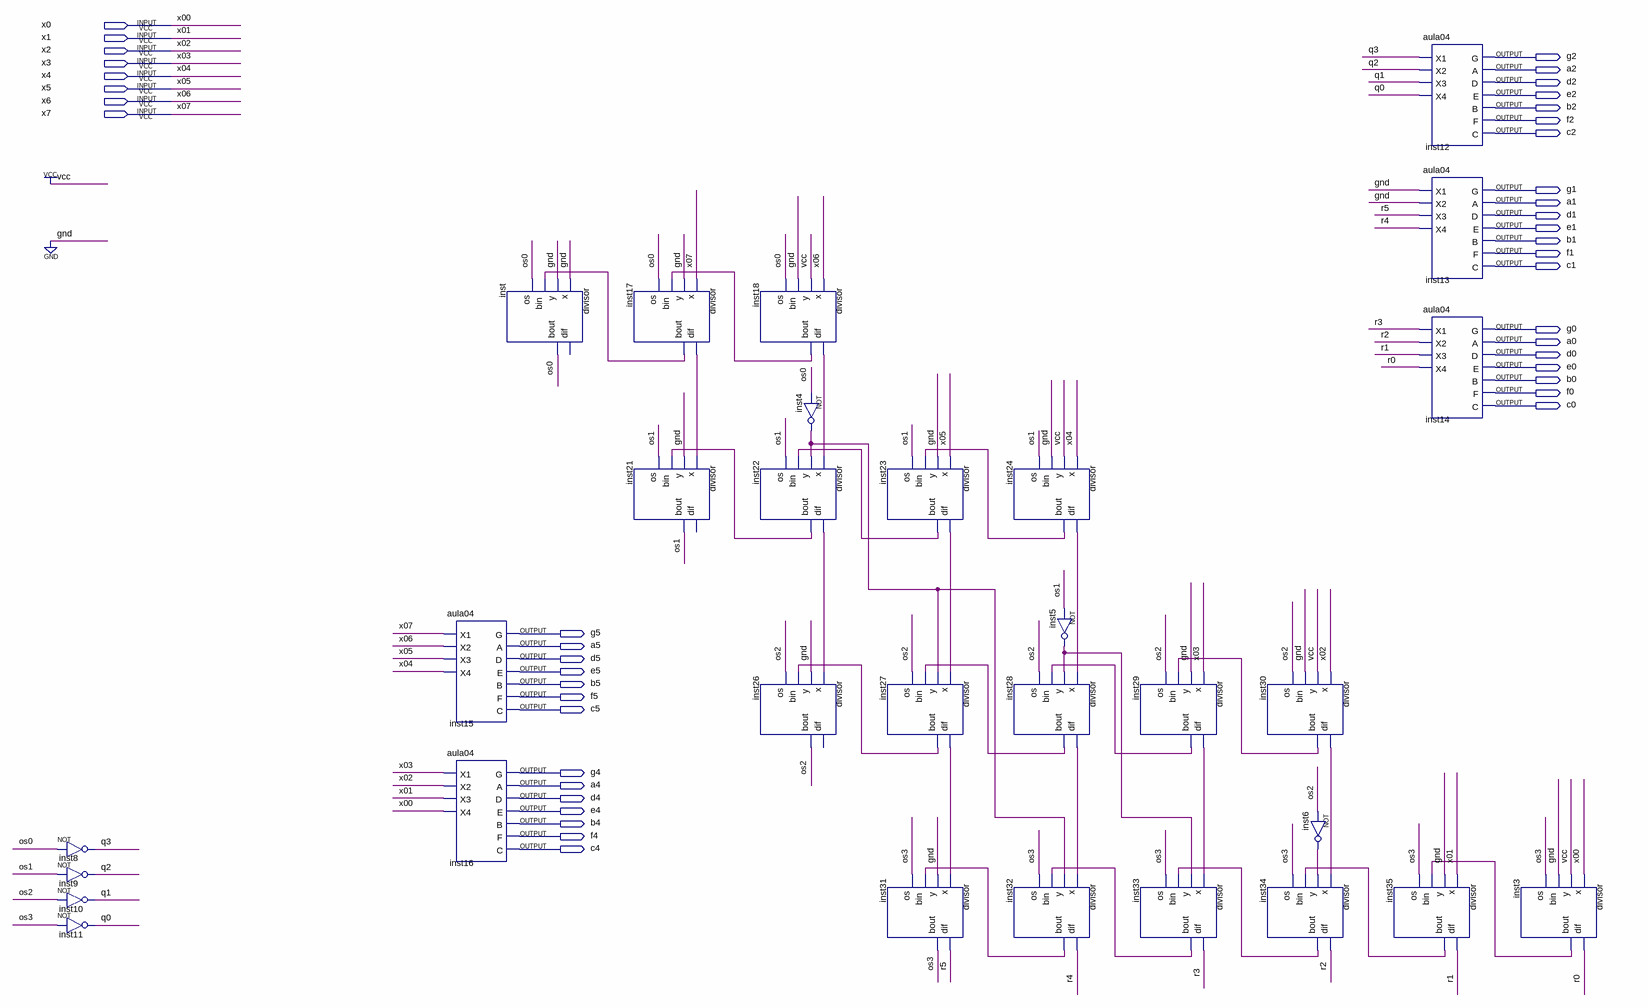
[diagram p0: schematic sheet]
// Quartus schematic aula12.bdf as structural Verilog: 30 symbols, 43 pins
module aula12 (
  input  x0,
  input  x1,
  input  x2,
  input  x3,
  input  x4,
  input  x5,
  input  x6,
  input  x7,
  output g2,
  output a2,
  output d2,
  output e2,
  output b2,
  output f2,
  output c2,
  output g1,
  output a1,
  output d1,
  output e1,
  output b1,
  output f1,
  output c1,
  output g0,
  output a0,
  output d0,
  output e0,
  output b0,
  output f0,
  output c0,
  output g5,
  output a5,
  output d5,
  output e5,
  output b5,
  output f5,
  output c5,
  output g4,
  output a4,
  output d4,
  output e4,
  output b4,
  output f4,
  output c4
);

  wire inst3_bout, inst4_out, inst5_out, inst6_out, inst17_bout, inst17_dif, inst18_bout, inst18_dif,
       inst22_bout, inst22_dif, inst23_bout, inst23_dif, inst24_bout, inst24_dif, inst27_bout, inst27_dif,
       inst28_bout, inst28_dif, inst29_bout, inst29_dif, inst30_bout, inst30_dif, inst32_bout, inst33_bout,
       inst34_bout, inst35_bout, os0, os1, os2, os3, q0, q1, q2, q3, r0, r1, r2, r3, r4, r5;

  not inst8 (q3, os0);
  not inst9 (q2, os1);
  not inst10 (q1, os2);
  not inst11 (q0, os3);
  aula04 inst15 (.X1(x7), .X2(x6), .X3(x5), .X4(x4), .G(g5), .A(a5), .D(d5), .E(e5), .B(b5), .F(f5), .C(c5));
  aula04 inst16 (.X1(x3), .X2(x2), .X3(x1), .X4(x0), .G(g4), .A(a4), .D(d4), .E(e4), .B(b4), .F(f4), .C(c4));
  divisor inst (.x(1'b0), .y(1'b0), .bin(inst17_bout), .os(os0), .bout(os0));  // open: dif
  divisor inst17 (.x(x7), .y(1'b0), .bin(inst18_bout), .os(os0), .dif(inst17_dif), .bout(inst17_bout));
  divisor inst21 (.x(inst17_dif), .y(1'b0), .bin(inst22_bout), .os(os1), .bout(os1));  // open: dif
  divisor inst18 (.x(x6), .y(1'b1), .bin(1'b0), .os(os0), .dif(inst18_dif), .bout(inst18_bout));
  divisor inst22 (.x(inst18_dif), .y(inst4_out), .bin(inst23_bout), .os(os1), .dif(inst22_dif), .bout(inst22_bout));
  divisor inst26 (.x(inst22_dif), .y(1'b0), .bin(inst27_bout), .os(os2), .bout(os2));  // open: dif
  not inst4 (inst4_out, os0);
  divisor inst23 (.x(x5), .y(1'b0), .bin(inst24_bout), .os(os1), .dif(inst23_dif), .bout(inst23_bout));
  divisor inst27 (.x(inst23_dif), .y(inst4_out), .bin(inst28_bout), .os(os2), .dif(inst27_dif), .bout(inst27_bout));
  divisor inst31 (.x(inst27_dif), .y(1'b0), .bin(inst32_bout), .os(os3), .dif(r5), .bout(os3));
  divisor inst24 (.x(x4), .y(1'b1), .bin(1'b0), .os(os1), .dif(inst24_dif), .bout(inst24_bout));
  divisor inst28 (.x(inst24_dif), .y(inst5_out), .bin(inst29_bout), .os(os2), .dif(inst28_dif), .bout(inst28_bout));
  divisor inst32 (.x(inst28_dif), .y(inst4_out), .bin(inst33_bout), .os(os3), .dif(r4), .bout(inst32_bout));
  not inst5 (inst5_out, os1);
  divisor inst29 (.x(x3), .y(1'b0), .bin(inst30_bout), .os(os2), .dif(inst29_dif), .bout(inst29_bout));
  divisor inst33 (.x(inst29_dif), .y(inst5_out), .bin(inst34_bout), .os(os3), .dif(r3), .bout(inst33_bout));
  divisor inst30 (.x(x2), .y(1'b1), .bin(1'b0), .os(os2), .dif(inst30_dif), .bout(inst30_bout));
  divisor inst34 (.x(inst30_dif), .y(inst6_out), .bin(inst35_bout), .os(os3), .dif(r2), .bout(inst34_bout));
  not inst6 (inst6_out, os2);
  divisor inst35 (.x(x1), .y(1'b0), .bin(inst3_bout), .os(os3), .dif(r1), .bout(inst35_bout));
  aula04 inst12 (.X1(q3), .X2(q2), .X3(q1), .X4(q0), .G(g2), .A(a2), .D(d2), .E(e2), .B(b2), .F(f2), .C(c2));
  aula04 inst13 (.X1(1'b0), .X2(1'b0), .X3(r5), .X4(r4), .G(g1), .A(a1), .D(d1), .E(e1), .B(b1), .F(f1), .C(c1));
  aula04 inst14 (.X1(r3), .X2(r2), .X3(r1), .X4(r0), .G(g0), .A(a0), .D(d0), .E(e0), .B(b0), .F(f0), .C(c0));
  divisor inst3 (.x(x0), .y(1'b1), .bin(1'b0), .os(os3), .dif(r0), .bout(inst3_bout));

  // Other names for the same wires on the sheet: x00 = x0; x01 = x1; x02 = x2; x03 = x3; x04 = x4; x05 = x5; x06 = x6;
  //   x07 = x7
endmodule
